# Altium project MFC.PrjPcb
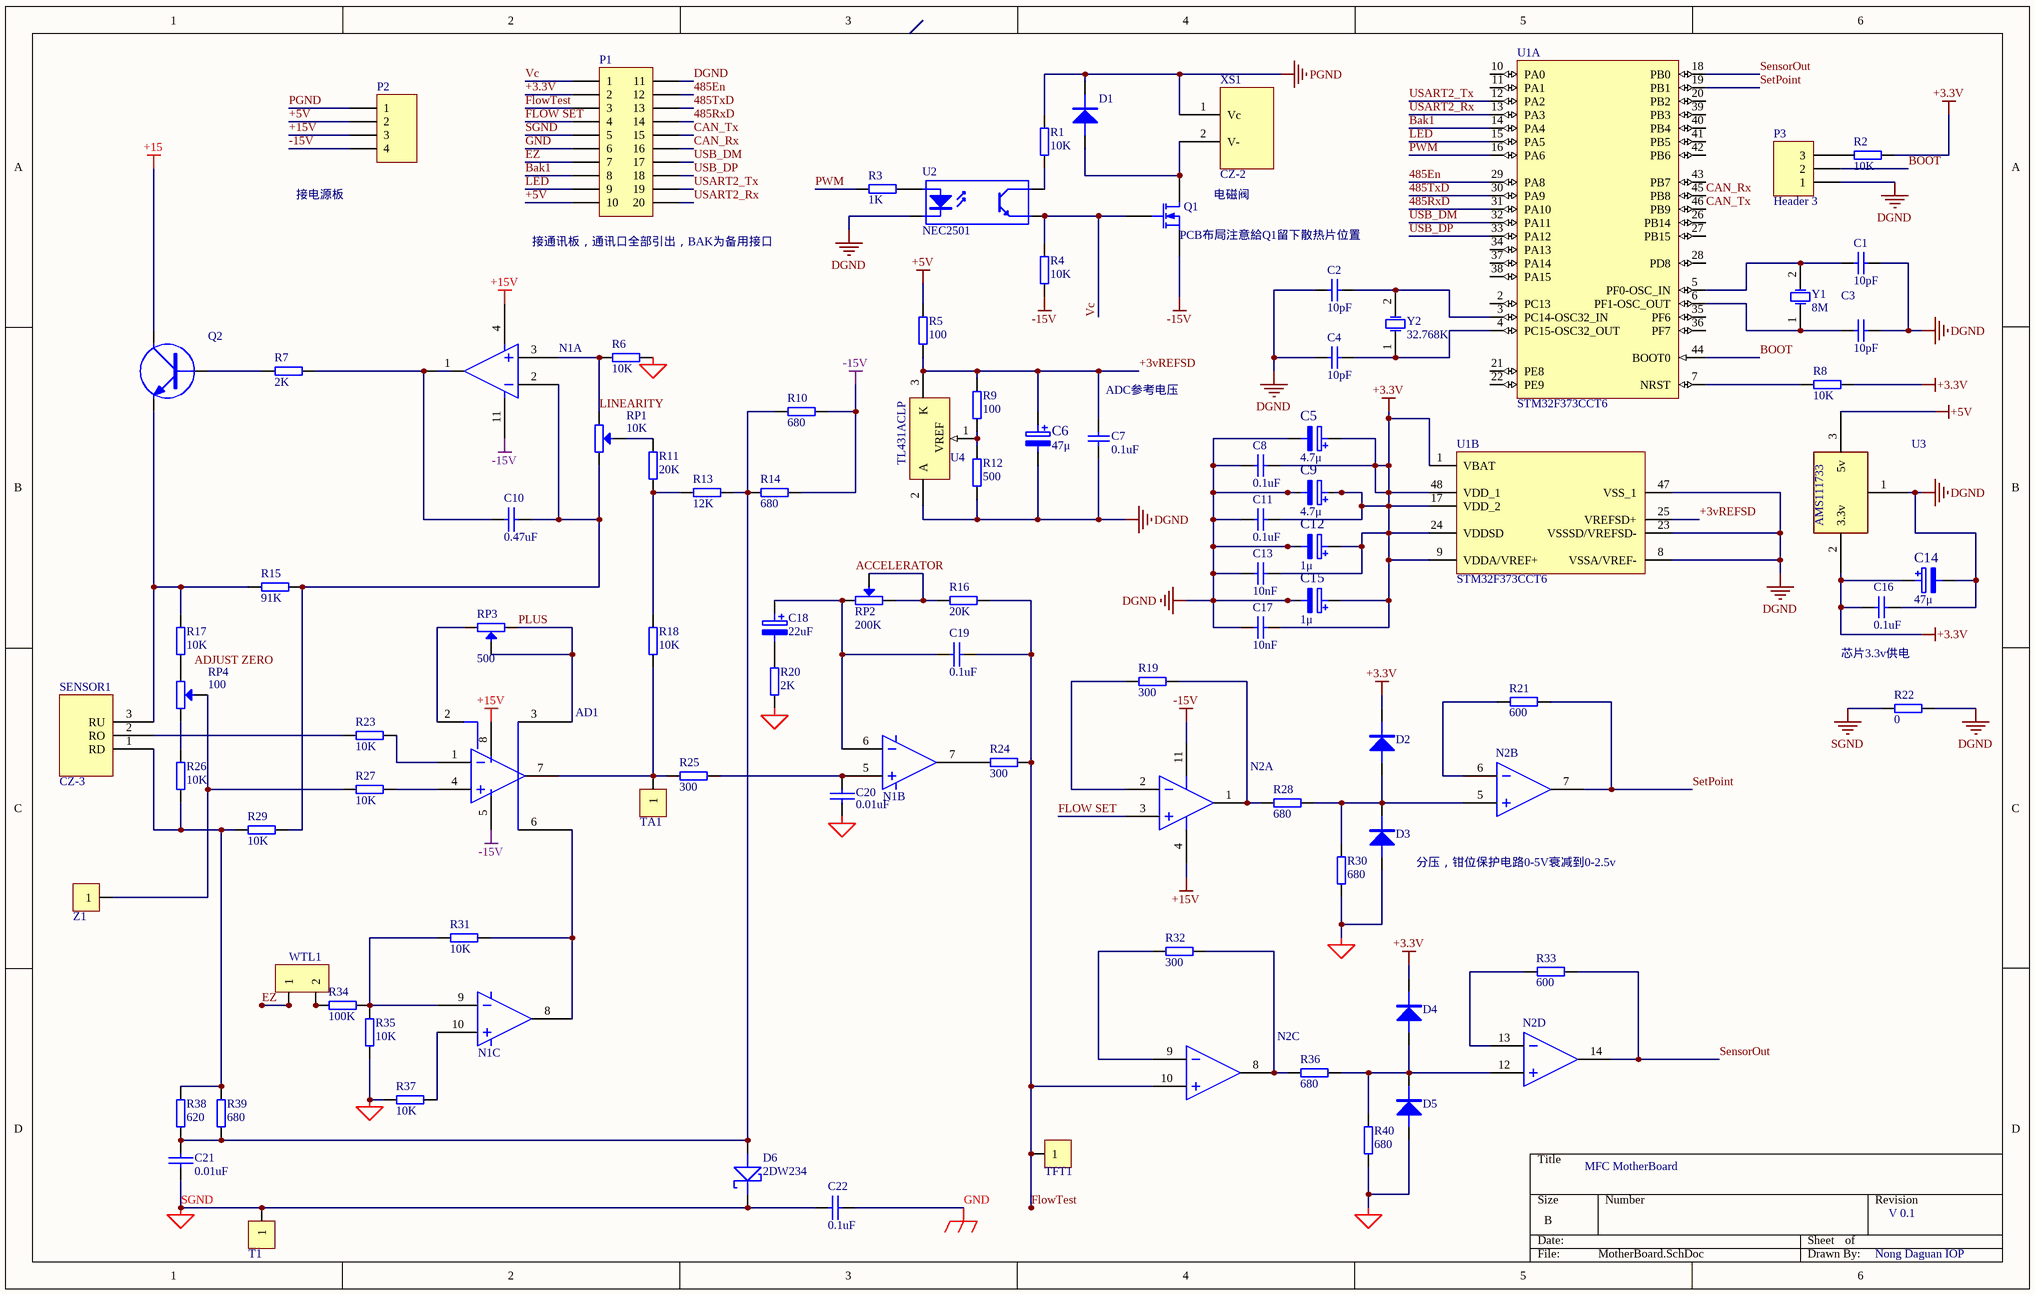
[diagram p0: MotherBoard.SchDoc]
3 sheets, 150 parts. Net scope: global (net labels, ports and power ports of the same name join across sheets).
Board files: MotherBoard.PcbDoc, CommBoard.PcbDoc, PowerBoard.PcbDoc
Sheets:
  MotherBoard.SchDoc
  CommBoard.SchDoc
  PowerBoard.SchDoc

## Sheet MotherBoard.SchDoc: MFC Mother Board
size B; Address1: aaa; Revision: V0.1

### Parts
AD1  (no value)  [SO-8]
C1  10pF  [R.4]
C2  10pF  [R.4]
C3  10pF  [R.4]
C4  10pF  [R.4]
C5  4.7μ  [CA-22U]
C6  47μ  [CA-22U]
C7  0.1uF  [R.4]
C8  0.1uF  [R.4]
C9  4.7μ  [CA-22U]
C10  0.47uF  [R.4]
C11  0.1uF  [R.4]
C12  1μ  [CA-22U]
C13  10nF  [R.4]
C14  47μ  [CA-22U]
C15  1μ  [CA-22U]
C16  0.1uF  [R.4]
C17  10nF  [R.4]
C18  22uF  [CA-22U]
C19  0.1uF  [R.4]
C20  0.01uF  [R.4]
C21  0.01uF  [R.4]
C22  0.1uF  [R.4]
D1  2CK73C  [V.4]  (value not drawn)
D2  2CK73C  [DIODE]  (value not drawn)
D3  2CK73C  [DIODE]  (value not drawn)
D4  2CK73C  [DIODE]  (value not drawn)
D5  2CK73C  [DIODE]  (value not drawn)
D6  2DW234  [zena]
N1  LM124  [SO-14]  (value not drawn)  (parts A,B,C of 4)
N2  LM124  [SO-14]  (value not drawn)  (parts A,B,C,D of 4)
P1  (no value)  [HDR2X10_CEN]
P2  (no value)  [HDR1X4]
P3  Header 3  [HDR1X3]
Q1  MOSFET-N  [TO-220AB]  (value not drawn)
Q2  MC9013  [BJT]  (value not drawn)
R1  10K  [R.4]
R2  10K  [R.4]
R3  1K  [R.4]
R4  10K  [R.4]
R5  100  [R.4]
R6  10K  [R.4]
R7  2K  [R.4]
R8  10K  [R.4]
R9  100  [RAD0.1]
R10  680  [R.4]
R11  20K  [R.4]
R12  500  [RAD0.1]
R13  12K  [R.4]
R14  680  [R.4]
R15  91K  [R.4]
R16  20K  [R.4]
R17  10K  [RAD0.1]
R18  10K  [R.4]
R19  300  [R.4]
R20  2K  [R.4]
R21  600  [R.4]
R22  0  [R.4]
R23  10K  [R.4]
R24  300  [R.4]
R25  300  [R.4]
R26  10K  [RAD0.1]
R27  10K  [R.4]
R28  680  [RAD0.1]
R29  10K  [R.4]
R30  680  [RAD0.1]
R31  10K  [R.4]
R32  300  [R.4]
R33  600  [R.4]
R34  100K  [R.4]
R35  10K  [R.4]
R36  680  [RAD0.1]
R37  10K  [R.4]
R38  620  [RAD0.1]
R39  680  [RAD0.1]
R40  680  [RAD0.1]
RP1  10K  [VR5132]
RP2  200K  [changable res]
RP3  500  [VR5132]
RP4  100  [VR5132]
SENSOR1  CZ-3  [SENSOR]
T1  CON1  [PAD - RECT]  (value not drawn)
TA1  CON1  [PAD - RECT]  (value not drawn)
TFT1  CON1  [PAD - RECT]  (value not drawn)
U1  STM32F373CCT6  [STM-LQFP48_N]  (parts A,B of 2)
U2  NEC2501  [DIP-4]
U3  AMS111733  [SOT223_N]
U4  TL431ACLP  [LP03]
WTL1  CON1  [ADJ]  (value not drawn)
XS1  CZ-2  [VALVE]
Y1  8M  [XTAL1]
Y2  32.768K  [XTAL1]
Z1  CON1  [PAD - RECT]  (value not drawn)

### Nets
+3.3V: C5.1 C8.2 C9.1 C11.2 C12.1 C13.2 C14.1 C15.1 C16.1 C17.2 D2.K D4.K P1.2 R2.2 R8.2 U1.1(VBAT) U1.9(VDDA/VREF+) U1.17(VDD_2) U1.24(VDDSD) U1.48(VDD_1) U3.2(3.3v)
+5V: P1.10 P2.2 R5.2 U3.3(5v)
+15: Q2.C
+15V: AD1.8 N1.4 N2.4(V+) P2.3
-15V: AD1.5 N1.11 N2.11(GND) P2.4 Q1.3(S) R4.1 R10.2 R14.2
DGND: C1.2 C2.1 C3.2 C4.1 C5.2 C6.2 C7.1 C8.1 C9.2 C11.1 C12.2 C13.1 C14.2 C15.2 C16.2 C17.1 P1.11 P3.1 R12.1 R22.2 U1.8(VSSA/VREF-) U1.23(VSSSD/VREFSD-) U1.47(VSS_1) U2.2(K) U3.1(GND) U4.2(A)
GND: C22.2 P1.6
PGND: D1.K P2.1 R1.2 XS1.1(Vc)
SGND: C20.1 C21.2 C22.1 D3.A D5.A D6.K(CATHODE) P1.5 R6.2 R20.1 R22.1 R30.1 R35.1 R37.2 R40.1 T1.1
485En: P1.12 U1.29(PA8)
485RxD: P1.14 U1.31(PA10)
485TxD: P1.13 U1.30(PA9)
+3vREFSD: C6.1 C7.2 R5.1 R9.1 U1.25(VREFSD+) U4.3(K)
Bak1: P1.8 U1.14(PA4)
BOOT: P3.2 U1.44(BOOT0)
CAN_Rx: P1.16 U1.45(PB8)
CAN_Tx: P1.15 U1.46(PB9)
EZ: P1.7 WTL1.1
FLOW SET: N2.3(INPUT1+) P1.4
FlowTest: C19.2 N2.10(INPUT3+) P1.3 R16.2 R24.2 TFT1.1
LED: P1.9 U1.15(PA5)
PWM: R3.1 U1.16(PA6)
SensorOut: N2.14(OUTPUT4) R33.2 U1.18(PB0)
SetPoint: N2.7(OUTPUT2) R21.2 U1.19(PB1)
USART2_Rx: P1.20 U1.13(PA3)
USART2_Tx: P1.19 U1.12(PA2)
USB_DM: P1.17 U1.32(PA11)
USB_DP: P1.18 U1.33(PA12)
Vc: P1.1 Q1.1(G) R4.2 U2.3(E)
NetAD1_1: AD1.1 R23.2
NetAD1_2: AD1.2 RP3.2
NetAD1_3: AD1.3 RP3.1 RP3.3
NetAD1_4: AD1.4 R27.2
NetAD1_6: AD1.6 N1.8 R31.2
NetAD1_7: AD1.7 R18.1 R25.1 TA1.1
NetC1_1: C1.1 U1.5(PF0-OSC_IN) Y1.2(OSC2)
NetC2_2: C2.2 U1.3(PC14-OSC32_IN) Y2.2(OSC2)
NetC3_1: C3.1 U1.6(PF1-OSC_OUT) Y1.1(OSC1)
NetC4_2: C4.2 U1.4(PC15-OSC32_OUT) Y2.1(OSC1)
NetC10_1: C10.1 N1.1 R7.2
NetC10_2: C10.2 N1.2 R15.2 R29.2 RP1.2
NetC18_1: C18.1 C19.1 N1.6 RP2.1
NetC18_2: C18.2 R20.2
NetC20_2: C20.2 N1.5 R25.2
NetC21_1: C21.1 D6.A(ANODE) R10.1 R13.2 R14.1 R38.1 R39.1
NetD1_A: D1.A Q1.2(D) XS1.2(V-)
NetD2_A: D2.A D3.K N2.5(INTPUT2+) R28.1 R30.2
NetD4_A: D4.A D5.K N2.12(INPUT4+) R36.1 R40.2
NetN1_3: N1.3 R6.1 RP1.1
NetN1_7: N1.7 R24.1
NetN1_9: N1.9 R31.1 R34.2 R35.2
NetN1_10: N1.10 R37.1
NetN2_1: N2.1(OUTPUT1) R19.2 R28.2
NetN2_2: N2.2(INPUT1-) R19.1
NetN2_6: N2.6(INPUT2-) R21.1
NetN2_8: N2.8(OUTPUT3) R32.2 R36.2
NetN2_9: N2.9(INPUT3-) R32.1
NetN2_13: N2.13(INPUT4-) R33.1
NetP3_3: P3.3 R2.1
NetQ2_B: Q2.B R7.1
NetQ2_E: Q2.E R15.1 R17.2 SENSOR1.3(RU)
NetR1_1: R1.1 U2.4(C)
NetR3_2: R3.2 U2.1(A)
NetR8_1: R8.1 U1.7(NRST)
NetR9_2: R9.2 R12.2 U4.1(VREF)
NetR11_1: R11.1 R13.1 R18.2
NetR11_2: R11.2 RP1.3
NetR16_1: R16.1 RP2.2 RP2.3
NetR17_1: R17.1 RP4.1
NetR23_1: R23.1 SENSOR1.2(RO)
NetR26_1: R26.1 R29.1 R38.2 R39.2 SENSOR1.1(RD)
NetR26_2: R26.2 RP4.2
NetR27_1: R27.1 RP4.3 Z1.1
NetR34_1: R34.1 WTL1.2

Not connected (* = marked no-connect by the designer): U1 2(PC13) 10(PA0) 11(PA1) 20(PB2) 21(PE8) 22(PE9) 26(PB14) 27(PB15) 28(PD8) 34(PA13) 35(PF6) 36(PF7) 37(PA14) 38(PA15) 39(PB3) 40(PB4) 41(PB5) 42(PB6) 43(PB7); U3 4

### Notes on the sheet
- 接电源板
- (near Q1) PCB布局注意給Q1留下散热片位置
- 电磁阀
- (near P1) 接通讯板，通讯口全部引出，BAK为备用接口
- (near RP1) LINEARITY
- (near C7) ADC参考电压
- (near RP2) ACCELERATOR
- (near RP3) PLUS
- ADJUST ZERO
- 芯片3.3v供电
- 分压，钳位保护电路0-5V衰减到0-2.5v
- MFC MotherBoard
- V 0.1
- Nong Daguan IOP

### Library data of the parts
AD1 = AD8221
C1 C3 = Cap: Capacitor; Value: 104; Published: 8-Jun-2000; LatestRevisionDate: 17-Jul-2002; LatestRevisionNote: Re-released for DXP Platform.; Publisher: Altium Limited
C2 C4 = CAP: Capacitor; Value: 10; Published: 8-Jun-2000; LatestRevisionDate: 17-Jul-2002; LatestRevisionNote: Re-released for DXP Platform.; Publisher: Altium Limited
C5 C6 C9 C12 C14 C15 C18 = ELECTRO2
C7 C8 C11 C13 C16 C17 = CAP: Capacitor; Value: 104; Published: 8-Jun-2000; LatestRevisionDate: 17-Jul-2002; LatestRevisionNote: Re-released for DXP Platform.; Publisher: Altium Limited
C10 C19-C22 = CAP
D1-D5 = DIODE
D6 = DIODE SCHOTTKY
N1 = MFC7A.S01_LM124_56
N2 = LM1241
P1 = Header 10X2A: Header, 10-Pin, Dual row; LatestRevisionDate: 17-Jul-2002; LatestRevisionNote: Re-released for DXP Platform.; Publisher: Altium Limited
P2 = Header 4: Header, 4-Pin; LatestRevisionDate: 17-Jul-2002; LatestRevisionNote: Re-released for DXP Platform.; Publisher: Altium Limited
P3 = Header 3: Header, 3-Pin; LatestRevisionDate: 17-Jul-2002; LatestRevisionNote: Re-released for DXP Platform.; Publisher: Altium Limited
Q1 = MOSFET-N: N-Channel MOSFET; Published: 8-Jun-2000; LatestRevisionDate: 17-Jul-2002; LatestRevisionNote: Re-released for DXP Platform.; PackageVersion: 1995/1996; PackageReference: E3; Publisher: Altium Limited; PackageDescription: TO, Flat Index; 3 In-Line, Axial Leads; Body Dia. 4.6mm; Lead Dia. 0.5 mm (max)
R1-R8 R10 R11 R13-R16 R18-R25 R27 R29 R31-R35 R37 = RES_1
R9 R12 R17 R26 R28 R30 R36 R38-R40 = RES
RP1 RP3 RP4 = POT2
RP2 = POT2: 3362
U1 = STM32F373CCT6: ARM Cortex-M4 32-bit MCU, 256 KB Flash, 32 KB Internal RAM, 36 I/Os, 48-pin LQFP, -40 to 85 degC, Tray; FLASH Size (Prog) (kB): 256; I/Os (High Current): 36; Internal RAM Size (kB): 32; Operating Frequency(F) (Processor speed) (MHz): 72; Supply Voltage(Vcc) min (V): 2; DatasheetVersion: Rev. 3; PackageVersion: Rev. 6, 06/2013; PackageReference: LQFP48; PackageDescription: 48-Pin Low Profile Quad Flat Package, 7 x 7 mm Body, 0.5 mm Pitch; Supplier 1: Digi-Key; Supplier Part Number 1: 497-13251-ND; Supplier 2: Farnell; Supplier Part Number 2: 2215117; Supplier 3: Newark; Supplier Part Number 3: 46W2195; Supplier 4: Newark; Supplier Part Number 4: 48W6893; Supplier 5: Mouser; Supplier Part Number 5: 511-STM32F373CCT6; Core: ARM Cortex-M4; Packing: Tray; Mounting Technology: Surface Mount; PartNumber: STM32F373CCT6; ComponentLink1Description: Manufacturer URL; ComponentLink1URL: http://www.st.com/web/en/home.html; ComponentLink2Description: Datasheet; ComponentLink2URL: http://www.st.com/st-web-ui/static/active/en/resource/technical/document/datasheet/DM00046749.pdf; ComponentLink3Description: Package Specification; ComponentLink3URL: http://www.st.com/st-web-ui/static/active/en/resource/technical/document/datasheet/DM00058181.pdf
U2 = Optoisolator1: 4-Pin Phototransistor Optocoupler; Published: 24-Mar-1999; LatestRevisionDate: 04-Mar-2005; LatestRevisionNote: Sch pins 3 & 4 Swapped.; DatasheetVersion: Nov-2003; PackageReference: DIP-4; Publisher: Altium Limited
U3 = TL431
U4 = TL431ACLP: Adjustable Precision Shunt Regulator; Published: 15-Apr-2002; LatestRevisionDate: 06-Jun-2005; LatestRevisionNote: Sch pins 1 & 3 swapped; DatasheetVersion: Oct-2000; PackageVersion: Nov-2001; PackageReference: LP03; Publisher: Altium Limited; PackageDescription: TO, Flat Index; 3 In-Line, Axial Leads; Body Dia. 4.8mm; Leads 0.56 x 0.41 mm (max); Code_JEDEC: TO-226-AA; ComponentLink1Description: Manufacturer Link; ComponentLink1URL: http://www.ti.com/; ComponentLink2Description: Datasheet; ComponentLink2URL: http://www-s.ti.com/sc/ds/tl431a.pdf
WTL1 = CON1_1
Y1 Y2 = XTAL: Crystal Oscillator; Published: 8-Jun-2000; LatestRevisionDate: 17-Jul-2002; LatestRevisionNote: Re-released for DXP Platform.; Publisher: Altium Limited

## Sheet CommBoard.SchDoc
size A4
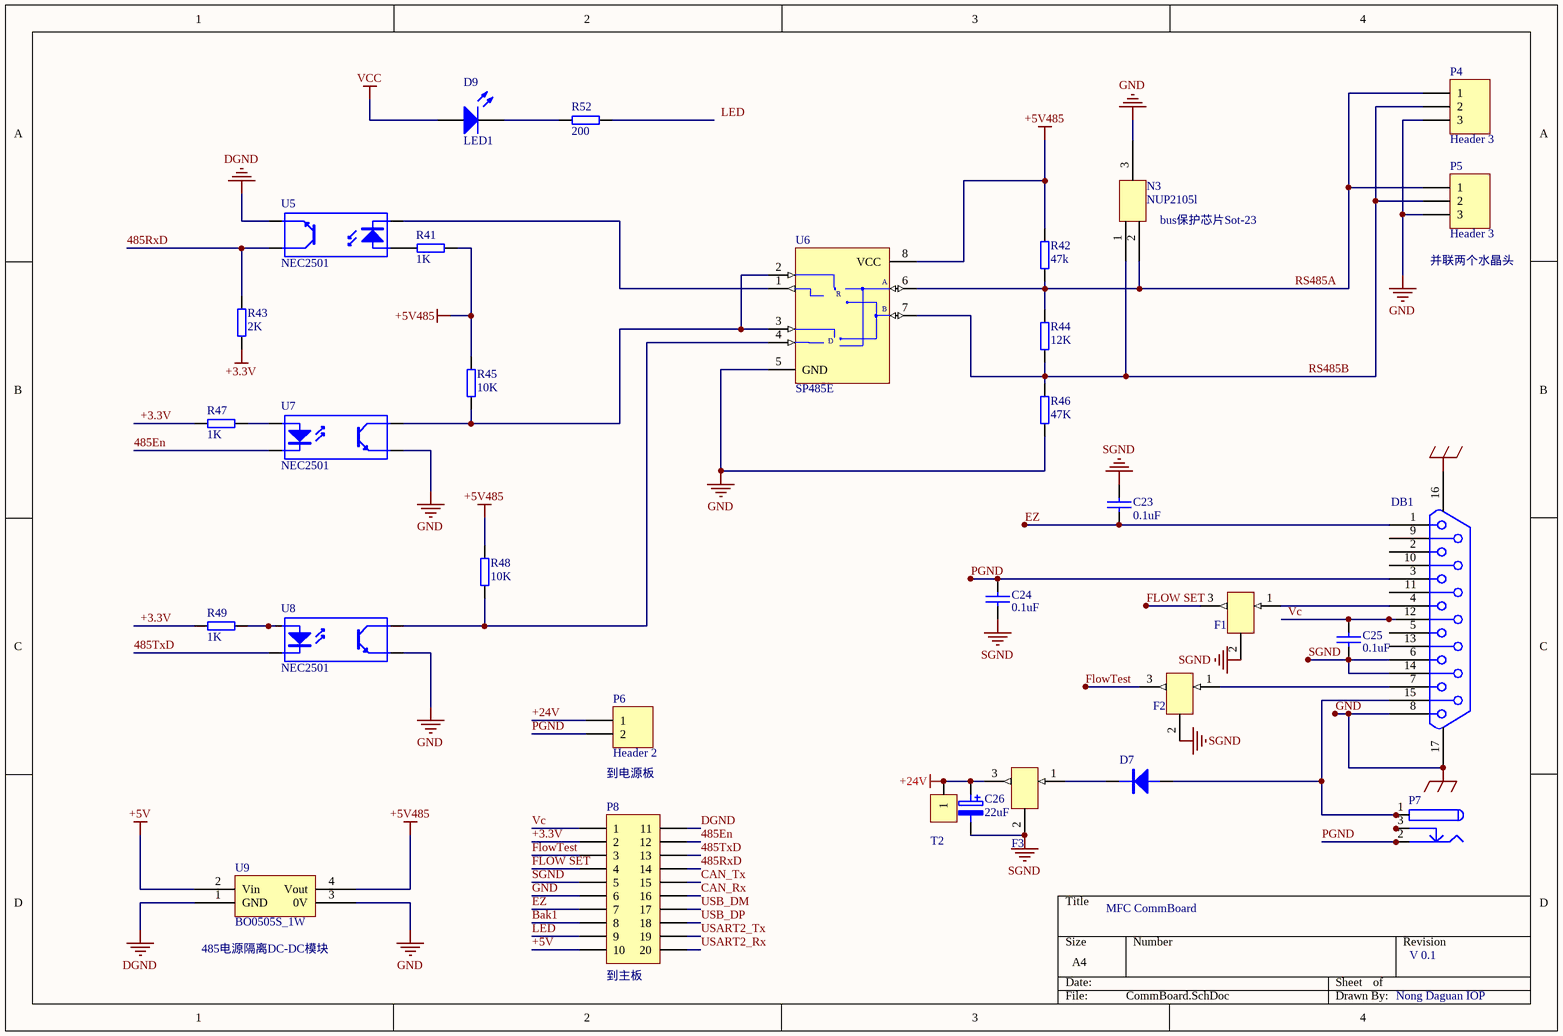
[diagram p1: CommBoard.SchDoc]

### Parts
C23  0.1uF  [R.4]
C24  0.1uF  [R.4]
C25  0.1uF  [R.4]
C26  22uF  [CA-22U]
D7  2CK73C  [DIODE]  (value not drawn)
D9  LED1  [LED-1]
DB1  DB15  [DB15RA/M]  (value not drawn)
F1  TL-221M 100V  [FILTER]  (value not drawn)
F2  TL-221M 100V  [FILTER]  (value not drawn)
F3  TL-221M 100V  [FILTER]  (value not drawn)
N3  NUP2105l
P4  Header 3  [HDR1X3]
P5  Header 3  [HDR1X3]
P6  Header 2  [HDR1X2]
P7  (no value)  [KLD-0202]
P8  (no value)  [HDR2X10_CEN]
R41  1K  [R.4]
R42  47k  [R.4]
R43  2K  [R.4]
R44  12K  [R.4]
R45  10K  [R.4]
R46  47K  [R.4]
R47  1K  [R.4]
R48  10K  [R.4]
R49  1K  [R.4]
R52  200  [R.4]
T2  CON1  [PAD - RECT]  (value not drawn)
U5  NEC2501  [DIP-4]
U6  SP485E  [SOT23-8]
U7  NEC2501  [DIP-4]
U8  NEC2501  [DIP-4]
U9  BO0505S_1W

### Nets
+3.3V: P8.2 R43.1 R47.1 R49.1
+5V: P8.10 U9.2(Vin)
+5V485: R41.2 R42.2 R45.2 R48.2 U6.8(VCC) U9.4(Vout)
+24V: C26.1 F3.3(OUT) P6.1 T2.1
DGND: P8.11 U5.3(E) U9.1(GND)
GND: DB1.8 DB1.16(Pad) DB1.17(Pad) N3.3 P4.3 P5.3 P8.6 R46.1 U6.5(GND) U7.3(E) U8.3(E) U9.3(0V)
PGND: C24.2 DB1.3 P6.2 P7.2 P7.2A P7.2B
SGND: C23.2 C24.1 C25.1 C26.2 DB1.6 DB1.14 F1.2(GND) F2.2(GND) F3.2(GND) P8.5
VCC: D9.1(A)
485En: P8.12 U7.2(K)
485RxD: P8.14 R43.2 U5.4(C)
485TxD: P8.13 U8.2(K)
Bak1: P8.8
CAN_Rx: P8.16
CAN_Tx: P8.15
EZ: C23.1 DB1.1 P8.7
FLOW SET: F1.3(OUT) P8.4
FlowTest: F2.3(OUT) P8.3
LED: P8.9
RS485A: N3.2 P4.1 P5.1 R42.1 R44.2 U6.6(A)
RS485B: N3.1 P4.2 P5.2 R44.1 R46.2 U6.7(B)
USART2_Rx: P8.20
USART2_Tx: P8.19
USB_DM: P8.17
USB_DP: P8.18
Vc: C25.2 DB1.12 P8.1
NetD7_A: D7.A DB1.15 P7.1 P7.1A P7.1B
NetD7_K: D7.K F3.1(IN)
NetD9_2: D9.2(K) R52.1
NetDB1_4: DB1.4 F1.1(IN)
NetDB1_7: DB1.7 F2.1(IN)
NetP7_3: P7.3 P7.3A P7.3B
NetR41_1: R41.1 U5.1(A)
NetR45_1: R45.1 U6.2(~{RE}) U6.3(DE) U7.4(C)
NetR47_2: R47.2 U7.1(A)
NetR48_1: R48.1 U6.4(DI) U8.4(C)
NetR49_2: R49.2 U8.1(A)
NetU5_2: U5.2(K) U6.1(RO)

Not connected (* = marked no-connect by the designer): DB1 2 5 9 10 11 13; R52 2

### Notes on the sheet
- (near N3) bus保护芯片Sot-23
- (near P5) 并联两个水晶头
- 到电源板
- MFC CommBoard
- (near U9) 485电源隔离DC-DC模块
- (near P8) 到主板
- V 0.1
- Nong Daguan IOP
- Labels drawn without touching a wire or pin: LED
- (in symbol D-221-0010) R; D

### Library data of the parts
C23-C25 = CAP
C26 = ELECTRO2
D7 = DIODE
D9 = LED1: Typical RED GaAs LED; Published: 8-Jun-2000; LatestRevisionDate: 08-Jul-2005; LatestRevisionNote: Mech Layer 1 removed.; PackageReference: LED-1; Publisher: Altium Limited; PackageDescription: LED; 2 Leads
F1-F3 = FILTER
P4 P5 = Header 3: Header, 3-Pin; LatestRevisionDate: 17-Jul-2002; LatestRevisionNote: Re-released for DXP Platform.; Publisher: Altium Limited
P6 = Header 2: Header, 2-Pin; LatestRevisionDate: 17-Jul-2002; LatestRevisionNote: Re-released for DXP Platform.; Publisher: Altium Limited
P7 = PWR2.5: Low Voltage Power Supply Connector; Publisher: Altium Limited; Published: 17-Dec-2003; DatasheetDocument: 09-May-2002; ComponentLink1Description: Manufacturer Link; ComponentLink1URL: http://domino.kycon.com/internet/Products.html
P8 = Header 10X2A: Header, 10-Pin, Dual row; LatestRevisionDate: 17-Jul-2002; LatestRevisionNote: Re-released for DXP Platform.; Publisher: Altium Limited
R41-R49 R52 = RES_1
U5 U7 U8 = Optoisolator1: 4-Pin Phototransistor Optocoupler; Published: 24-Mar-1999; LatestRevisionDate: 04-Mar-2005; LatestRevisionNote: Sch pins 3 & 4 Swapped.; DatasheetVersion: Nov-2003; PackageReference: DIP-4; Publisher: Altium Limited
U6 = D-221-0010: MAX3362 3.3V, High-Speed, RS-485/RS-422 Transceiver in  SOT Package; Comm Standard: None; Mounting Technology: Surface Mount; Status: Unreleased; Category: IC-Communication

## Sheet PowerBoard.SchDoc
size A4
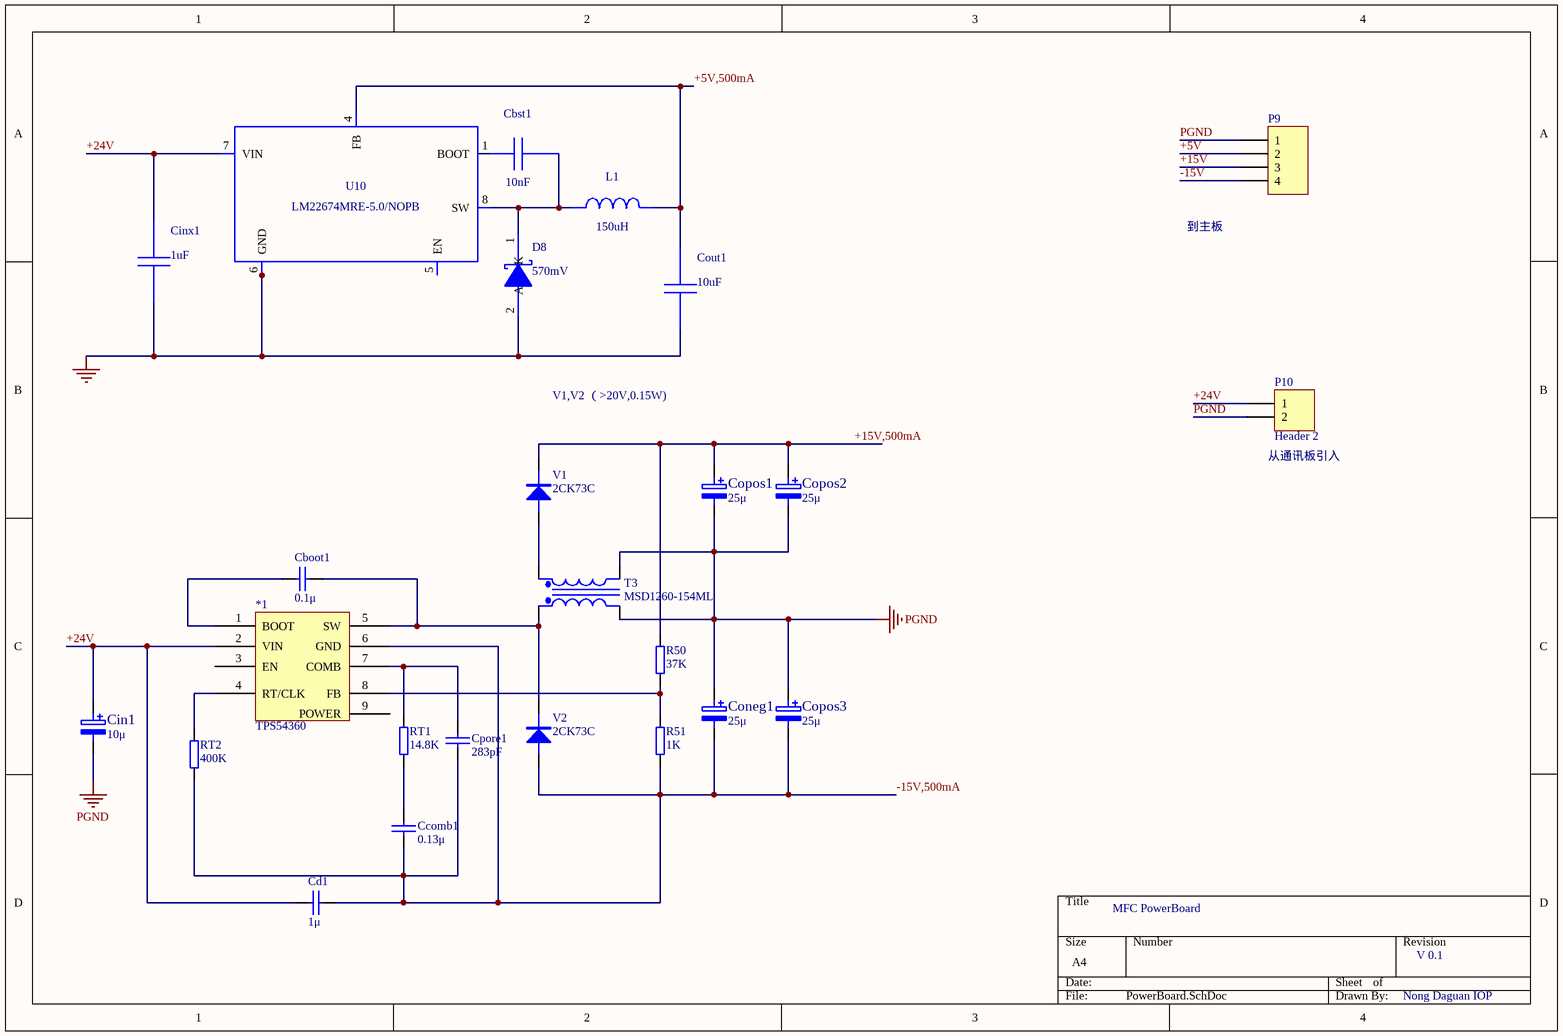
[diagram p2: PowerBoard.SchDoc]

### Parts
*1  TPS54360
Cboot1  0.1μ  [C.1]
Cbst1  value 10nF  (hidden comment: C0805C103K5RACTU)
Ccomb1  0.13μ  [C.1]
Cd1  1μ  [C.1]
Cin1  10μ  [CA-22U]
Cinx1  value 1uF  (hidden comment: C1608X5R1H105K080AB)
Coneg1  25μ  [CA-22U]
Copos1  25μ  [CA-22U]
Copos2  25μ  [CA-22U]
Copos3  25μ  [CA-22U]
Cout1  value 10uF  (hidden comment: C0805C106K8PACTU)
Cpore1  283pF  [C.1]
D8  value 570mV  (hidden comment: PMEG6010CEH,115)
L1  value 150uH  (hidden comment: VLP8040T-151M)
P9  (no value)  [HDR1X4]
P10  Header 2  [HDR1X2]
R50  37K  [R.4]
R51  1K  [R.4]
RT1  14.8K  [R.4]
RT2  400K  [R.4]
T3  MSD1260-154ML  [TRF_4]
U10  LM22674MRE-5.0/NOPB
V1  2CK73C  [V.4]
V2  2CK73C  [V.4]

### Nets
+5V: P9.2
+15V: P9.3
+24V: *1.2(VIN) Cd1.1 Cin1.1 Cinx1.1 P10.1 U10.7(VIN)
-15V: P9.4
PGND: Cin1.2 Cinx1.2 Coneg1.1 Copos1.2 Copos2.2 Copos3.1 Cout1.2 D8.2(A) P9.1 P10.2 T3.2(Pri-) T3.4(Sec-) U10.2(NC) U10.3(NC) U10.6(GND) U10.9(DAP)
+5V,500mA: Cout1.1 L1.2 U10.4(FB)
+15V,500mA: Copos1.1 Copos2.1 R50.2 V1.K
-15V,500mA: *1.6(GND) Ccomb1.2 Cd1.2 Coneg1.2 Copos3.2 Cpore1.2 R51.1 RT2.2 V2.A
Net*1_1: *1.1(BOOT) Cboot1.1
Net*1_4: *1.4(RT/CLK) RT2.1
Net*1_5: *1.5(SW) Cboot1.2 T3.1(Pri+) V2.K
Net*1_7: *1.7(COMB) Cpore1.1 RT1.1
Net*1_8: *1.8(FB) R50.1 R51.2
NetCbst1_1: Cbst1.1 D8.1(K) L1.1 U10.8(SW)
NetCbst1_2: Cbst1.2 U10.1(BOOT)
NetCcomb1_1: Ccomb1.1 RT1.2
NetT3_3: T3.3(Sec+) V1.A

Not connected (* = marked no-connect by the designer): *1 3(EN) 9(POWER); U10 5(EN)

### Notes on the sheet
- 到主板
- V1,V2 （>20V,0.15W)
- (near P10) 从通讯板引入
- MFC PowerBoard
- V 0.1
- Nong Daguan IOP

### Library data of the parts
Cboot1 Ccomb1 Cd1 Cpore1 = CAP
Cbst1 = C0805C103K5RACTU: Manufacturer Name: Kemet; PackageReference: C0805C103K5RACTU; Manufacturer Part Number: C0805C103K5RACTU
Cin1 Coneg1 Copos1-Copos3 = ELECTRO2
Cinx1 = C1608X5R1H105K080AB: C1608X5R1H105K08; Manufacturer Name: TDK; PackageReference: C1608X5R1H105K080AB; Manufacturer Part Number: C1608X5R1H105K080AB
Cout1 = C0805C106K8PACTU: Manufacturer Name: Kemet; PackageReference: C0805C106K8PACTU; Manufacturer Part Number: C0805C106K8PACTU
D8 = PMEG6010CEH,115: Manufacturer Name: Nexperia; PackageReference: PMEG6010CEH,115; Manufacturer Part Number: PMEG6010CEH,115
L1 = VLP8040T-151M: Unknown; Manufacturer Name: TDK; PackageReference: VLP8040T-151M; Manufacturer Part Number: VLP8040T-151M
P9 = Header 4: Header, 4-Pin; LatestRevisionDate: 17-Jul-2002; LatestRevisionNote: Re-released for DXP Platform.; Publisher: Altium Limited
P10 = Header 2: Header, 2-Pin; LatestRevisionDate: 17-Jul-2002; LatestRevisionNote: Re-released for DXP Platform.; Publisher: Altium Limited
R50 R51 RT1 RT2 = RES_1
T3 = Trans Cupl: Transformer (Coupled Inductor Model); Published: 8-Jun-2000; LatestRevisionDate: 17-Jul-2002; LatestRevisionNote: Re-released for DXP Platform.; PackageReference: TRF_4; Publisher: Altium Limited; PackageDescription: Transformer; 4 Leads
U10 = LM22674MRE-5.0/NOPB: LM22674MRE-5.0/N; Manufacturer Name: Texas Instruments; PackageReference: LM22674MRE-5.0/NOPB; Manufacturer Part Number: LM22674MRE-5.0/NOPB; Value: Value
V1 V2 = DIODE

## Nets that join several sheets
+3.3V: MotherBoard (21 pins), CommBoard (P8.2 R43.1 R47.1 R49.1)
+5V: MotherBoard (P1.10 P2.2 R5.2 U3.3), CommBoard (P8.10 U9.2), PowerBoard (P9.2)
+15V: MotherBoard (AD1.8 N1.4 N2.4 P2.3), PowerBoard (P9.3)
+24V: CommBoard (C26.1 F3.3 P6.1 T2.1), PowerBoard (6 pins)
-15V: MotherBoard (8 pins), PowerBoard (P9.4)
DGND: MotherBoard (26 pins), CommBoard (P8.11 U5.3 U9.1)
GND: MotherBoard (C22.2 P1.6), CommBoard (12 pins)
PGND: MotherBoard (D1.K P2.1 R1.2 XS1.1), CommBoard (6 pins), PowerBoard (16 pins)
SGND: MotherBoard (15 pins), CommBoard (10 pins)
485En: MotherBoard (P1.12 U1.29), CommBoard (P8.12 U7.2)
485RxD: MotherBoard (P1.14 U1.31), CommBoard (P8.14 R43.2 U5.4)
485TxD: MotherBoard (P1.13 U1.30), CommBoard (P8.13 U8.2)
Bak1: MotherBoard (P1.8 U1.14), CommBoard (P8.8)
CAN_Rx: MotherBoard (P1.16 U1.45), CommBoard (P8.16)
CAN_Tx: MotherBoard (P1.15 U1.46), CommBoard (P8.15)
EZ: MotherBoard (P1.7 WTL1.1), CommBoard (C23.1 DB1.1 P8.7)
FLOW SET: MotherBoard (N2.3 P1.4), CommBoard (F1.3 P8.4)
FlowTest: MotherBoard (6 pins), CommBoard (F2.3 P8.3)
LED: MotherBoard (P1.9 U1.15), CommBoard (P8.9)
USART2_Rx: MotherBoard (P1.20 U1.13), CommBoard (P8.20)
USART2_Tx: MotherBoard (P1.19 U1.12), CommBoard (P8.19)
USB_DM: MotherBoard (P1.17 U1.32), CommBoard (P8.17)
USB_DP: MotherBoard (P1.18 U1.33), CommBoard (P8.18)
Vc: MotherBoard (P1.1 Q1.1 R4.2 U2.3), CommBoard (C25.2 DB1.12 P8.1)